# Altium schematic sheet LED.SchDoc
size A4
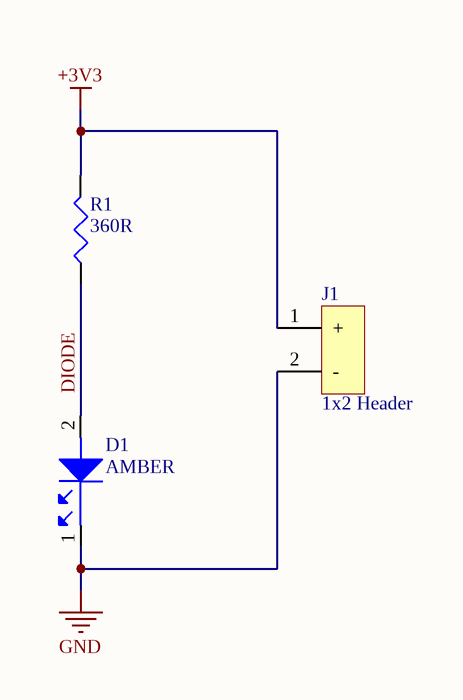
[diagram p0: LED.SchDoc]

## Parts
D1  AMBER  [LED0603AMBER]
J1  1x2 Header  [HEADER1x2]
R1  360R  [R0805]

## Nets
+3V3: J1.1(+) R1.2
GND: D1.1 J1.2(-)
DIODE: D1.2 R1.1

## Library data of the parts
D1 = LNJ437W84RA: PANASONIC - LNJ437W84RA - LED, AMBER, 0.8MM X 1.1MM, 25MCD, 590NM; Manufacturer: Panasonic SSG; Color: Orange; Forward Voltage: 1.95V; Forward Current: 5mA; Lens Style: Rectangular; Number of LEDs: 1; Max Power Dissipation: 55mW; Reverse Voltage: 4V; Supplier 1: Digi-Key; Supplier Part Number 1: LNJ437W84RACT-ND; Manufacturer Part Number: LNJ437W84RA; RoHS: Yes; Category: Optoeletronics; Stock 1: 118867; Pricing 1: 1=0,31000, 10=0,20200, 100=0,14490, 500=0,12154, 1000=0,11417 (USD); Mount: Surface Mount; Case/Package: 0603; Number of Pins: 2; Case Code (Metric): 1608; Case Code (Imperial): 0603; Min Operating Temperature: -30°C; Max Operating Temperature: 85°C; Wavelength: 590nm; Luminous Intensity: 25mcd; Package Quantity: 5000; Packaging: Tape and Reel; Illumination Color: Orange; Test Current: 5mA; Dominant Wavelength: 590nm; Length: 1.6mm; Height: 0.2mm; Width: 0.8mm; REACH SVHC: No SVHC; Lead Free: Lead Free; ComponentLink1URL: https://datasheet.ciiva.com/4689/lnj437w84ra-aek-226228-4689972.pdf?src-supplier=Mouser; ComponentLink1Description: https://datasheet.ciiva.com/4689/lnj437w84ra-aek-226228-4689972.pdf?src-supplier=Mouser; ComponentLink2URL: https://datasheet.ciiva.com/8028/lnj437w84ra-aek-8028645.pdf?src-supplier=Element14; ComponentLink2Description: https://datasheet.ciiva.com/8028/lnj437w84ra-aek-8028645.pdf?src-supplier=Element14; ComponentLink3URL: https://datasheet.ciiva.com/11775/0900766b80f0a8c0-11775375.pdf?src-supplier=RSComponents; ComponentLink3Description: https://datasheet.ciiva.com/11775/0900766b80f0a8c0-11775375.pdf?src-supplier=RSComponents
J1 = 22-29-2021: Conn Wire to Board HDR 2 POS 2.54mm Solder ST Thru-Hole Bag; Manufacturer: Molex; Number of Positions: 2; Connector Type: Header,Male Pin; Gender: Male; Voltage Rating (DC): 250V; Contact Post Length: 0.14inch; Glow Wire Compliant: Non-compliant; Supplier 1: Digi-Key; Manufacturer Part Number: 22-29-2021; RoHS: Yes; Category: Connectors; Stock 1: 6750; Pricing 1: 1=0,48000, 10=0,45200, 100=0,31630, 500=0,27112, 1000=0,22593, 5000=0,19365, 10000=0,18074 (USD); Mount: Through Hole; Color: White; Contact Plating: Gold; Contact Material: Brass; Contact Shape: Square; Insulation Material: Nylon; Insulation Color: Natural; Max Operating Temperature: 80°C; Number of Rows: 1; Packaging: Bag; Termination: Solder; Fastening Type: Friction; Contact Mating Length: 0.295inch; Insulation Height: 0.461inch; Lead Free: Lead Free; Halogen Free: Low Halogen; Flammability Rating: UL94 V-0; ComponentLink1URL: https://datasheet.ciiva.com/70131/022292021-sd-70131706.pdf?src-supplier=Digi-Key; ComponentLink1Description: https://datasheet.ciiva.com/70131/022292021-sd-70131706.pdf?src-supplier=Digi-Key; Supplier Part Number 1: WM2744-ND
R1 = CRCW080536R0FKEA: RES, THICK FILM, 36R, 1%, 0.125W, 0805; Product Range:AEC-Q200 CRCW Series; Resistance:36ohm; Power Rating:125mW; Resistance Tolerance: 1%; Voltage Rating:150V; Resistor Case Style:0805 [2012 Metric]; Packaging:Cut Tape ;RoHS Compliant: Yes; Manufacturer: Vishay; Temperature Coefficient: 100ppm/°C; Max Power Dissipation: 125mW; Voltage Rating (DC): 150V; Supplier 1: Digi-Key; Supplier Part Number 1: 541-36.0CCT-ND; Manufacturer Part Number: CRCW080536R0FKEA; RoHS: Yes; Category: Resistors; Stock 1: 14507; Pricing 1: 1=0,10000, 10=0,06200, 100=0,02540, 1000=0,01142, 2500=0,00991 (USD); Case/Package: 0805; Number of Pins: 2; Weight: 0.000194oz; Case Code (Metric): 2012; Case Code (Imperial): 0805; Contact Plating: Tin; Min Operating Temperature: -55°C; Max Operating Temperature: 155°C; Resistance: 36R; Tolerance: 1%; Packaging: Tape and Reel; Package Quantity: 5000; Composition: Thick Film; Number of Terminations: 2; Features: Automotive AEC-Q200; Power Rating: 125mW; Voltage Rating: 150V; Termination: SMD/SMT; Military Standard: Not; Length: 2mm; Height: 0.02inch; Width: 0.049inch; Depth: 1.25mm; Lead Free: Lead Free; REACH SVHC: Unknown; ComponentLink1URL: https://datasheet.ciiva.com/5936/1697337-5936166.pdf?src-supplier=Farnell; ComponentLink1Description: https://datasheet.ciiva.com/5936/1697337-5936166.pdf?src-supplier=Farnell; ComponentLink2URL: https://datasheet.ciiva.com/2467/dcrcwe3-2467497.pdf?src-supplier=Digi-Key; ComponentLink2Description: https://datasheet.ciiva.com/2467/dcrcwe3-2467497.pdf?src-supplier=Digi-Key; ComponentLink3URL: https://datasheet.ciiva.com/22674/1912744-22674873.pdf?src-supplier=Element14; ComponentLink3Description: https://datasheet.ciiva.com/22674/1912744-22674873.pdf?src-supplier=Element14; ComponentLink4URL: https://datasheet.ciiva.com/2467/dcrcwe3-2467498.pdf?src-supplier=Digi-Key; ComponentLink4Description: https://datasheet.ciiva.com/2467/dcrcwe3-2467498.pdf?src-supplier=Digi-Key; ComponentLink5URL: https://datasheet.ciiva.com/22705/1697337-22705578.pdf?src-supplier=Element14; ComponentLink5Description: https://datasheet.ciiva.com/22705/1697337-22705578.pdf?src-supplier=Element14; ComponentLink6URL: https://datasheet.ciiva.com/2467/dcrcwe3-2467499.pdf?src-supplier=Digi-Key; ComponentLink6Description: https://datasheet.ciiva.com/2467/dcrcwe3-2467499.pdf?src-supplier=Digi-Key; ComponentLink7URL: https://datasheet.ciiva.com/9013/dcrcwe3-9013853.pdf?src-supplier=Avnet; ComponentLink7Description: https://datasheet.ciiva.com/9013/dcrcwe3-9013853.pdf?src-supplier=Avnet; ComponentLink8URL: https://datasheet.ciiva.com/5550/dcrcwe3-109170-5550495.pdf?src-supplier=Mouser; ComponentLink8Description: https://datasheet.ciiva.com/5550/dcrcwe3-109170-5550495.pdf?src-supplier=Mouser; ComponentLink9URL: https://datasheet.ciiva.com/26316/fld-crcw-e3-data-en-26316527.pdf?src-supplier=Distrelec; ComponentLink9Description: https://datasheet.ciiva.com/26316/fld-crcw-e3-data-en-26316527.pdf?src-supplier=Distrelec